# EAGLE design audio_breakout (EAGLE 6.5.0)
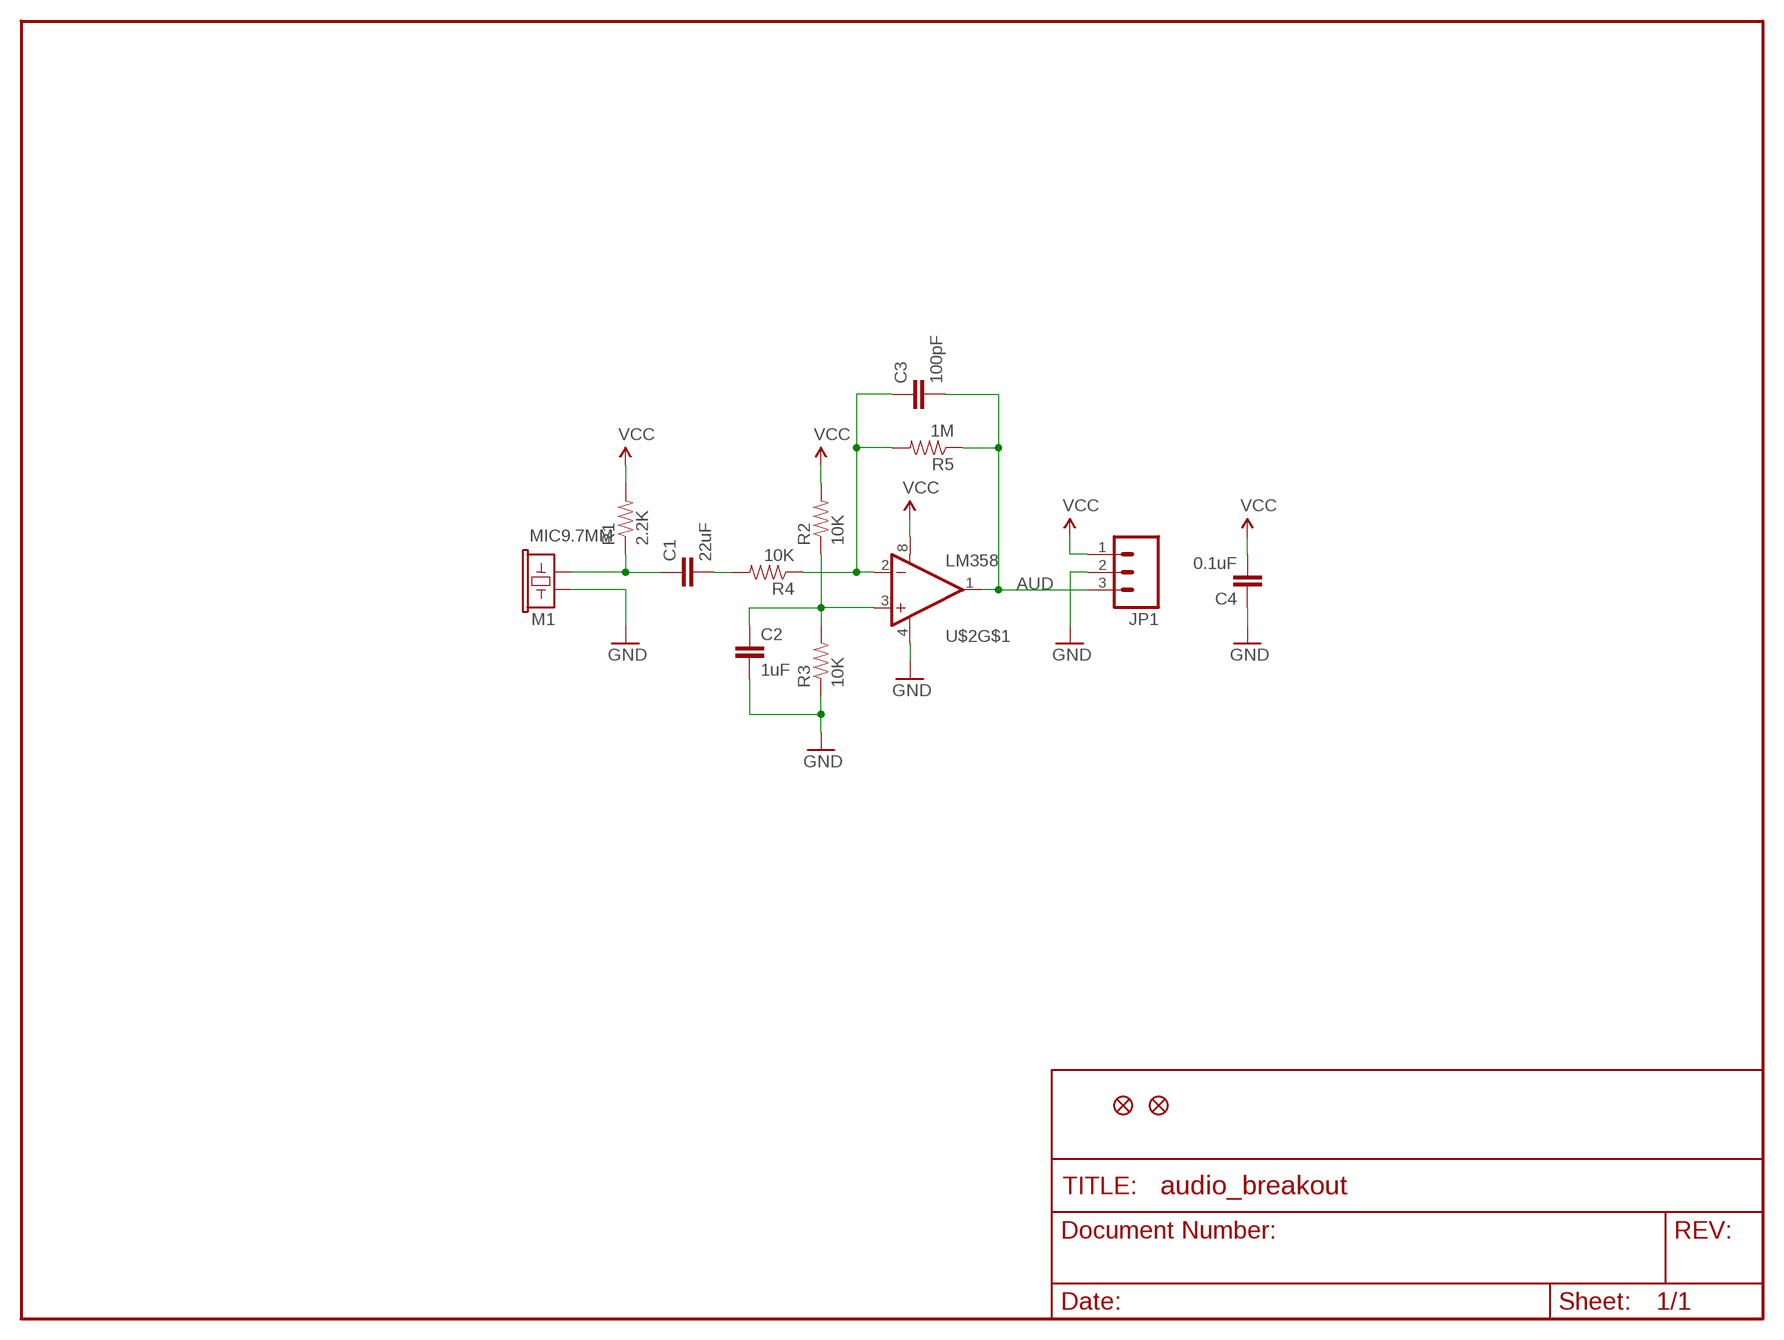
[diagram p0: schematic, sheet 1]

## Parts
C1  22uF  CAP1206  [1206]
C2  1uF  CAP1206  [1206]
C3  100pF  CAP1206  [1206]
C4  0.1uF  CAP1206  [1206]
JP1  M03PTH  [1X03]
JP2  FIDUCIAL1X2  [FIDUCIAL-1X2]
JP3  FIDUCIAL1X2  [FIDUCIAL-1X2]
M1  MIC9.7MM  [MIC-9.7MM]
R1  2.2K  RESISTOR1206  [1206]
R2  10K  RESISTOR1206  [1206]
R3  10K  RESISTOR1206  [1206]
R4  10K  RESISTOR1206  [1206]
R5  1M  RESISTOR1206  [1206]
U$2  LM358  [DIP08]

## Nets
AUD: C3.2 JP1.3 R5.1 U$2.1(OUT)
GND: C2.2 C4.1 JP1.2 M1.2 R3.1 U$2.4(V-)
N$1: C1.1 M1.1 R1.1
N$2: C3.1 R4.1 R5.2 U$2.2(-IN)
N$6: C1.2 R4.2
N$7: C2.1 R2.1 R3.2 U$2.3(+IN)
VCC: C4.2 JP1.1 R1.2 R2.2 U$2.8(V+)
Unconnected: U$2.5(+IN) U$2.6(-IN) U$2.7(OUT)

## Library data of the parts
C1-C4 = SparkFun:CAP: Capacitor Standard 0603 ceramic capacitor, and 0.1" leaded capacitor.
JP1 = SparkFun:M03: Header 3 Standard 3-pin 0.1" header. Use with straight break away headers (SKU : PRT-00116), right angle break away headers (PRT-00553), swiss pins (PRT-00743), machine pins (PRT-00117), and female headers (PRT-00115). Molex polarized connector foot print use with SKU : PRT-08232 with associated crimp pins and housings.
JP2 JP3 = SparkFun:FIDUCIAL: Fiducial Alignment Points Various fiducial points for machine vision alignment.
M1 = SparkFun:MIC: Microphone Omni-directional electret microphone. 9.7mm standard diameter.
R1-R5 = SparkFun:RESISTOR: Resistor Basic schematic elements and footprints for 0603, 1206, and PTH resistors.
U$2 = SparkFun:LM358

## Board
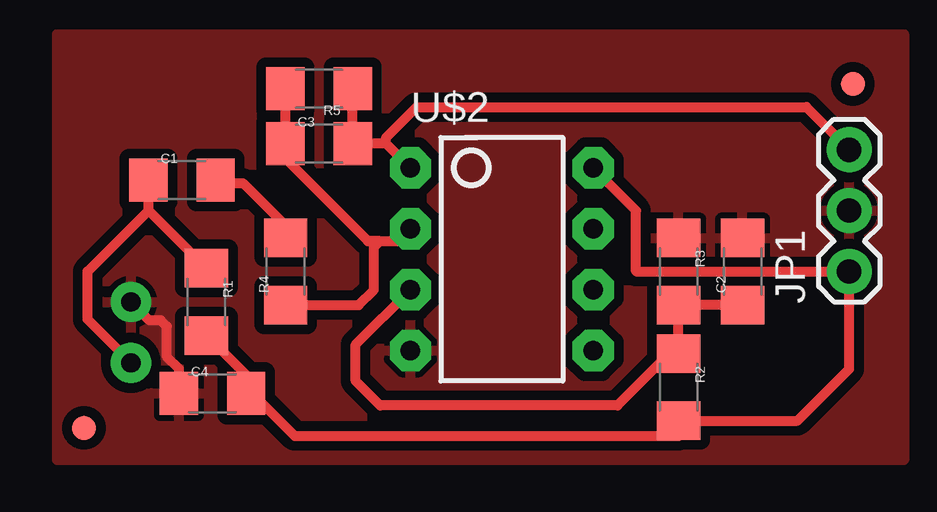
[diagram p1: board, top side]
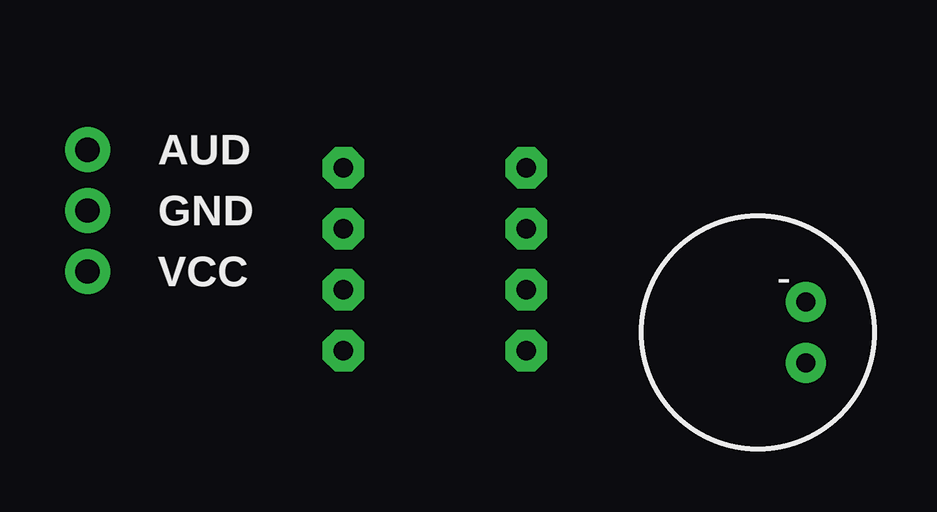
[diagram p2: board, bottom side, seen from below]

No outline drawn. Coordinates in mm, seen from the top.
Copper layers (1*16): Top 0.035mm / dielectric 1.5mm / Bottom 0.035mm
Design rules "SparkFun *": minimum track width 8mil, minimum drill 20mil, track to track 8mil, track to pad 8mil, pad to pad 8mil, via to via 8mil, smd to smd 8mil, copper to edge 9mil, drill to drill 8mil, minimum pad ring 12mil, minimum via ring 10mil, stop-mask expansion 4mil, vias tented up to drill 20mil, thermal gap 10mil

### Footprints (pad centres in the part's own frame; a part is rotated, then mirrored left to right if it is on the bottom)
1206 = smd 1.6 x 1.8: 1 -1.4,0; 2 1.4,0
1X03 = drill 1.016 pad 1.88: 1 0,0; 2 2.54,0; 3 5.08,0
FIDUCIAL-1X2 = smd 1 x 1: 1 0,0
MIC-9.7MM = drill 0.8 pad 1.676: 1 -2,1.27; 2 -2,-1.27
DIP08 = drill 0.813 pad 1.727 octagon: 1 -3.81,-3.81; 2 -1.27,-3.81; 3 1.27,-3.81; 4 3.81,-3.81; 5 3.81,3.81; 6 1.27,3.81; 7 -1.27,3.81; 8 -3.81,3.81

### Placement (x,y rotation side)
C1  5.21,11.43 0 top
C2  28.57,7.62 90 top
C3  10.92,12.95 0 top
C4  6.48,2.54 0 top
JP1  33.02,7.62 90 top
JP2  33.17,15.44 0 top
JP3  1.12,1.09 0 top
M1  5.08,5.08 180 bottom
R1  6.22,6.35 270 top
R2  25.91,2.79 270 top
R3  25.91,7.62 270 top
R4  9.53,7.62 90 top
R5  10.92,15.24 180 top
U$2  18.54,8.13 270 top

### Tracks (layer width: path | path; a pad name or v marks a point on that pad's centre or on a via)
AUD
  Top 0.406: R5.1 C3.2 13.72,12.95 | 32.77,12.95 JP1.3 31.24,14.48 14.99,14.48 13.72,13.21 13.72,12.95 | U$2.1 13.72,12.95
GND
  Top 0.406: C4.1 5.08,3.56 4.57,4.06 4.57,5.33 4.32,5.59 3.84,5.59 M1.2
  pour Top (isolate 0.406): 0,-0.25 0,17.53 35.31,17.53 35.31,-0.25
N$1
  Top 0.406: R1.1 3.81,10.17 | 3.81,10.17 C1.1 | M1.1 1.27,5.62 1.27,7.62 3.81,10.16 3.81,10.17
N$2
  Top 0.406: R5.2 C3.1 9.4,12.83 9.4,12.45 12.95,8.89 13.46,8.89 | R4.1 12.57,6.22 13.21,6.86 13.21,8.64 13.46,8.89 | 13.46,8.89 14.22,8.89 U$2.2
N$6
  Top 0.406: C1.2 6.73,11.3 7.75,11.3 9.4,9.65 9.4,9.15 R4.2
N$7
  Top 0.406: C2.1 R3.2 R2.1 25.53,4.19 23.37,2.03 13.46,2.03 12.45,3.05 12.45,4.57 U$2.3
VCC
  Top 0.406: R1.2 8.13,3.05 8.13,2.79 C4.2 8.13,2.54 9.91,0.76 25.91,0.76 R2.2 30.86,1.39 33.02,3.56 JP1.1 24.13,7.62 24.13,10.16 U$2.8

### Text on the board
bPlace: AUD | GND | VCC
tValues: DNP | Mic on opposite side